# EAGLE design IA-prop (EAGLE 6.1)
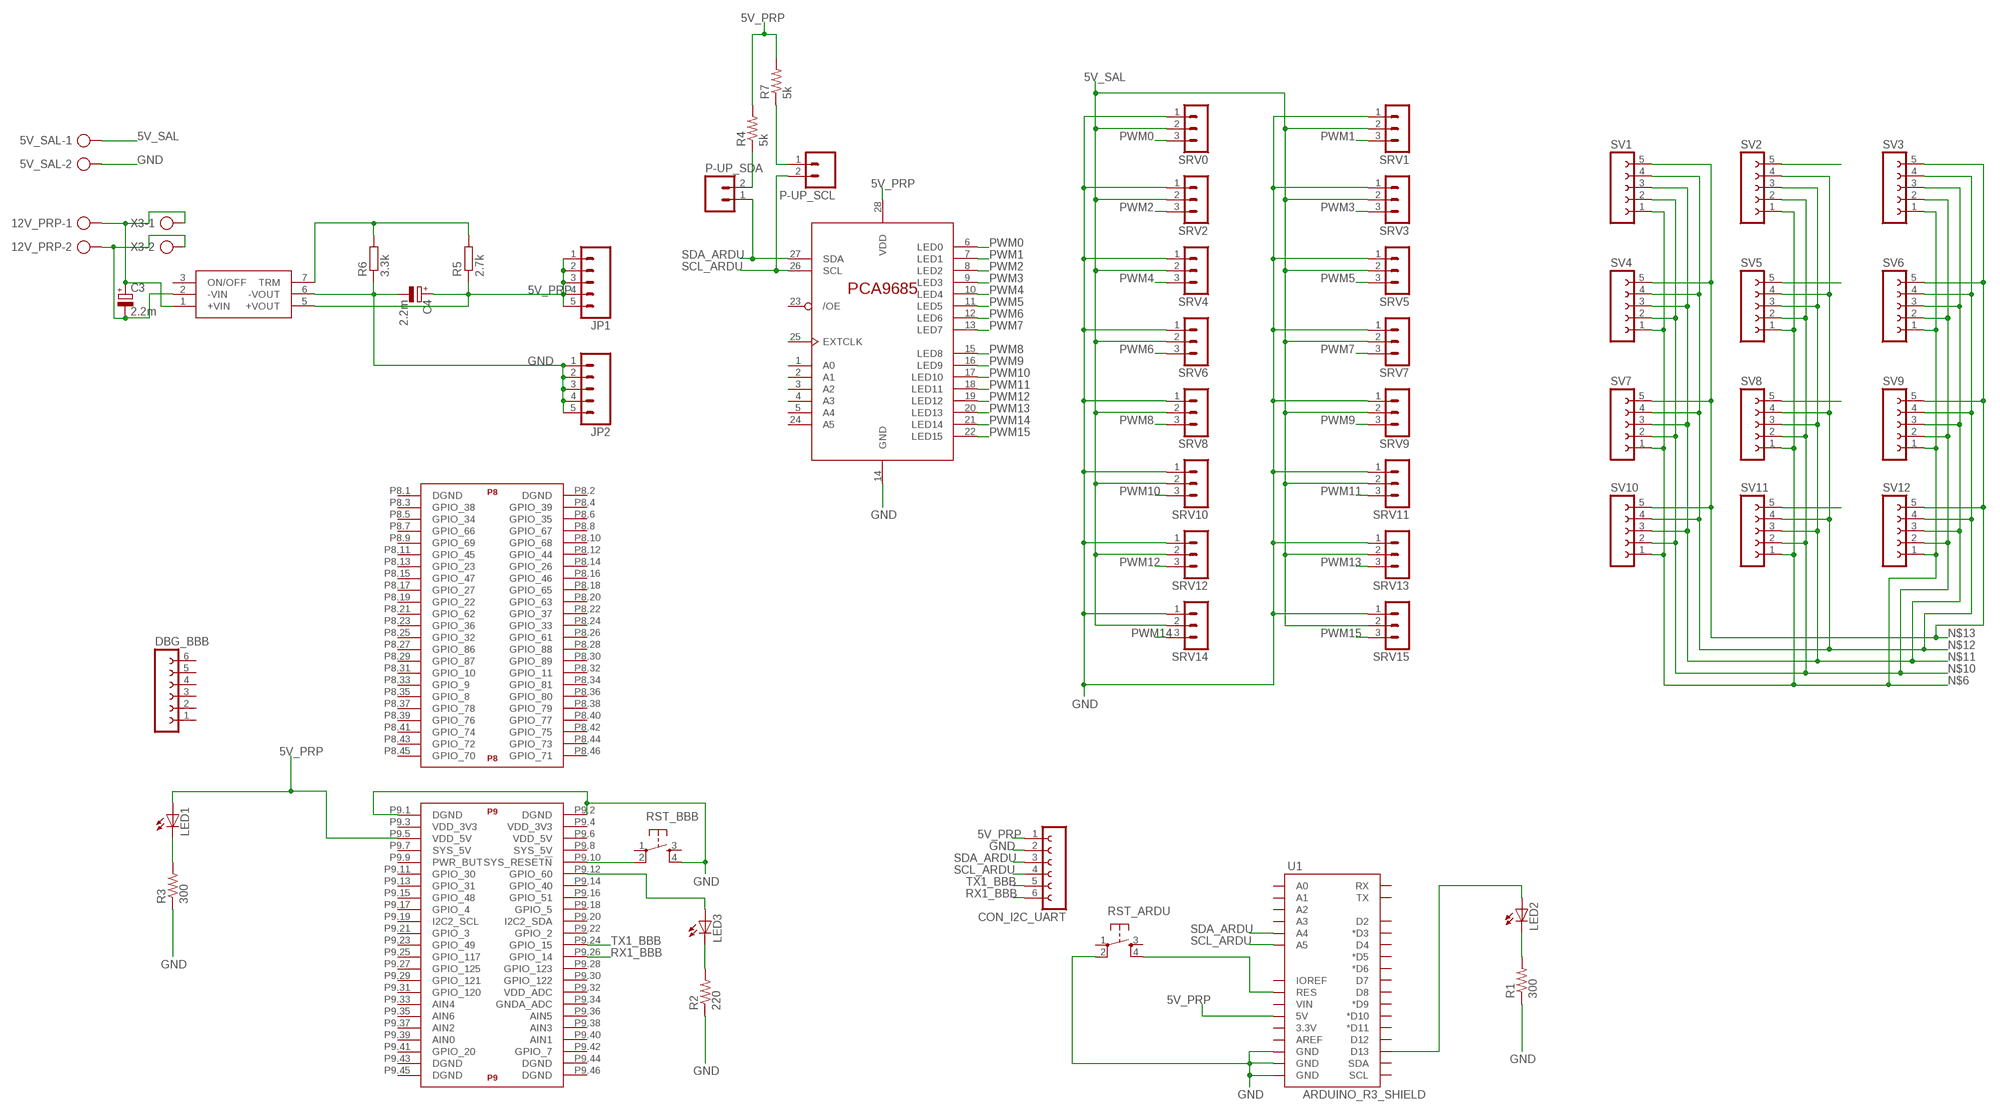
[diagram p0: schematic, sheet 1]

## Parts
5V_SAL  AK300/2  [AK300/2]
12V_PRP  AK300/2  [AK300/2]
C3  2.2m  CPOL-EUE5-13  [E5-13]
C4  2.2m  CPOL-EUE5-13  [E5-13]
CON_I2C_UART  FE06-1  [FE06]
DBG_BBB  FE06-1  [FE06]
JP1  M05PTH  [1X05]
JP2  M05PTH  [1X05]
LED1  LED3MM  [LED3MM]
LED2  LED3MM  [LED3MM]
LED3  LED3MM  [LED3MM]
P-UP_SCL  M02PTH  [1X02]
P-UP_SDA  M02PTH  [1X02]
R1  300  RESISTORAXIAL-0.3  [AXIAL-0.3]
R2  220  RESISTORAXIAL-0.3  [AXIAL-0.3]
R3  300  RESISTORAXIAL-0.3  [AXIAL-0.3]
R4  5k  RESISTORAXIAL-0.3  [AXIAL-0.3]
R5  2.7k  R-EU_0207/7  [0207/7]
R6  3.3k  R-EU_0207/7  [0207/7]
R7  5k  RESISTORAXIAL-0.3  [AXIAL-0.3]
RST_ARDU  TAC_SWITCHPTH  [TACTILE-PTH]
RST_BBB  TAC_SWITCHPTH  [TACTILE-PTH]
SRV0  MA03-1  [MA03-1]
SRV1  MA03-1  [MA03-1]
SRV2  MA03-1  [MA03-1]
SRV3  MA03-1  [MA03-1]
SRV4  MA03-1  [MA03-1]
SRV5  MA03-1  [MA03-1]
SRV6  MA03-1  [MA03-1]
SRV7  MA03-1  [MA03-1]
SRV8  MA03-1  [MA03-1]
SRV9  MA03-1  [MA03-1]
SRV10  MA03-1  [MA03-1]
SRV11  MA03-1  [MA03-1]
SRV12  MA03-1  [MA03-1]
SRV13  MA03-1  [MA03-1]
SRV14  MA03-1  [MA03-1]
SRV15  MA03-1  [MA03-1]
SV1  FE05-1  [FE05-1]
SV2  FE05-1  [FE05-1]
SV3  FE05-1  [FE05-1]
SV4  FE05-1  [FE05-1]
SV5  FE05-1  [FE05-1]
SV6  FE05-1  [FE05-1]
SV7  FE05-1  [FE05-1]
SV8  FE05-1  [FE05-1]
SV9  FE05-1  [FE05-1]
SV10  FE05-1  [FE05-1]
SV11  FE05-1  [FE05-1]
SV12  FE05-1  [FE05-1]
U1  ARDUINO_R3_SHIELD  [UNO_R3_SHIELD]
U$1  PCA9685PW  [TSSOP28]
U$2  TEN25-1211TEN25-1211  [TEN25]
U$3  BEAGLE_BONE_BLACK_CAPE  [BEAGLE_BONE_BLACK_CAPE]
X3  AK300/2  [AK300/2]

## Nets
5V_PRP: C4.+ CON_I2C_UART.1 JP1.1 JP1.2 JP1.3 JP1.4 JP1.5 LED1.A R4.P$2 R5.1 R7.P$2 U1.5V U$1.28(VDD) U$2.5(+VOUT) U$3.P9.5(P9:VDD_5V)
5V_PRP1: LED2.A U1.D13
5V_PRP2: LED3.A U$3.P9.12(P9:GPIO_60)
5V_SAL: 5V_SAL.1 SRV0.2 SRV1.2 SRV2.2 SRV3.2 SRV4.2 SRV5.2 SRV6.2 SRV7.2 SRV8.2 SRV9.2 SRV10.2 SRV11.2 SRV12.2 SRV13.2 SRV14.2 SRV15.2
+12V: 12V_PRP.1 C3.+ U$2.1(+VIN) X3.1
GND: 5V_SAL.2 C4.- CON_I2C_UART.2 JP2.1 JP2.2 JP2.3 JP2.4 JP2.5 R1.P$1 R2.P$1 R3.P$1 R6.1 RST_ARDU.2 RST_BBB.4 SRV0.1 SRV1.1 SRV2.1 SRV3.1 SRV4.1 SRV5.1 SRV6.1 SRV7.1 SRV8.1 SRV9.1 SRV10.1 SRV11.1 SRV12.1 SRV13.1 SRV14.1 SRV15.1 U1.GND@0(GND) U1.GND@1(GND) U1.GND@2(GND) U$1.14(GND) U$2.6(-VOUT) U$3.P9.1(P9:DGND) U$3.P9.2(P9:DGND)
GND_12: 12V_PRP.2 C3.- U$2.2(-VIN) X3.2
N$1: RST_BBB.2 U$3.P9.10(P9:SYS_RESET!N)
N$2: LED2.K(C) R1.P$2
N$3: LED3.K(C) R2.P$2
N$4: R5.2 R6.2 U$2.7(TRM)
N$5: P-UP_SDA.2 R4.P$1
N$6: SV1.1 SV2.1 SV3.1 SV4.1 SV5.1 SV6.1 SV7.1 SV8.1 SV9.1 SV10.1 SV11.1 SV12.1
N$7: LED1.K(C) R3.P$2
N$8: RST_ARDU.4 U1.RES
N$9: P-UP_SCL.1 R7.P$1
N$10: SV1.2 SV2.2 SV3.2 SV4.2 SV5.2 SV6.2 SV7.2 SV8.2 SV9.2 SV10.2 SV11.2 SV12.2
N$11: SV1.3 SV2.3 SV3.3 SV4.3 SV5.3 SV6.3 SV7.3 SV8.3 SV9.3 SV10.3 SV11.3 SV12.3
N$12: SV1.4 SV2.4 SV3.4 SV4.4 SV5.4 SV6.4 SV7.4 SV8.4 SV9.4 SV10.4 SV11.4 SV12.4
N$13: SV1.5 SV3.5 SV4.5 SV6.5 SV7.5 SV9.5 SV10.5 SV12.5
N$23: SV5.5
N$38: SV8.5
N$48: SV2.5
N$63: SV11.5
PWM0: SRV0.3 U$1.6(LED0)
PWM1: SRV1.3 U$1.7(LED1)
PWM2: SRV2.3 U$1.8(LED2)
PWM3: SRV3.3 U$1.9(LED3)
PWM4: SRV4.3 U$1.10(LED4)
PWM5: SRV5.3 U$1.11(LED5)
PWM6: SRV6.3 U$1.12(LED6)
PWM7: SRV7.3 U$1.13(LED7)
PWM8: SRV8.3 U$1.15(LED8)
PWM9: SRV9.3 U$1.16(LED9)
PWM10: SRV10.3 U$1.17(LED10)
PWM11: SRV11.3 U$1.18(LED11)
PWM12: SRV12.3 U$1.19(LED12)
PWM13: SRV13.3 U$1.20(LED13)
PWM14: SRV14.3 U$1.21(LED14)
PWM15: SRV15.3 U$1.22(LED15)
RX1_BBB: CON_I2C_UART.6 U$3.P9.26(P9:GPIO_14)
SCL_ARDU: CON_I2C_UART.4 P-UP_SCL.2 U1.A5 U$1.26(SCL)
SDA_ARDU: CON_I2C_UART.3 P-UP_SDA.1 U1.A4 U$1.27(SDA)
TX1_BBB: CON_I2C_UART.5 U$3.P9.24(P9:GPIO_15)
Unconnected: DBG_BBB.1 DBG_BBB.2 DBG_BBB.3 DBG_BBB.4 DBG_BBB.5 DBG_BBB.6 RST_ARDU.1 RST_ARDU.3 RST_BBB.1 RST_BBB.3 U1.3.3V U1.A0 U1.A1 U1.A2 U1.A3 U1.AREF U1.D2 U1.D3(*D3) U1.D4 U1.D5(*D5) U1.D6(*D6) U1.D7 U1.D8 U1.D9(*D9) U1.D10(*D10) U1.D11(*D11) U1.D12 U1.IOREF U1.RX U1.SCL U1.SDA U1.TX U1.VIN U$1.1(A0) U$1.2(A1) U$1.3(A2) U$1.4(A3) U$1.5(A4) U$1.23(/OE) U$1.24(A5) U$1.25(EXTCLK) U$2.3(ON/OFF) U$3.P8.1(P8:DGND) U$3.P8.2(P8:DGND) U$3.P8.3(P8:GPIO_38) U$3.P8.4(P8:GPIO_39) U$3.P8.5(P8:GPIO_34) U$3.P8.6(P8:GPIO_35) U$3.P8.7(P8:GPIO_66) U$3.P8.8(P8:GPIO_67) U$3.P8.9(P8:GPIO_69) U$3.P8.10(P8:GPIO_68) U$3.P8.11(P8:GPIO_45) U$3.P8.12(P8:GPIO_44) U$3.P8.13(P8:GPIO_23) U$3.P8.14(P8:GPIO_26) U$3.P8.15(P8:GPIO_47) U$3.P8.16(P8:GPIO_46) U$3.P8.17(P8:GPIO_27) U$3.P8.18(P8:GPIO_65) U$3.P8.19(P8:GPIO_22) U$3.P8.20(P8:GPIO_63) U$3.P8.21(P8:GPIO_62) U$3.P8.22(P8:GPIO_37) U$3.P8.23(P8:GPIO_36) U$3.P8.24(P8:GPIO_33) U$3.P8.25(P8:GPIO_32) U$3.P8.26(P8:GPIO_61) U$3.P8.27(P8:GPIO_86) U$3.P8.28(P8:GPIO_88) U$3.P8.29(P8:GPIO_87) U$3.P8.30(P8:GPIO_89) U$3.P8.31(P8:GPIO_10) U$3.P8.32(P8:GPIO_11) U$3.P8.33(P8:GPIO_9) U$3.P8.34(P8:GPIO_81) U$3.P8.35(P8:GPIO_8) U$3.P8.36(P8:GPIO_80) U$3.P8.37(P8:GPIO_78) U$3.P8.38(P8:GPIO_79) U$3.P8.39(P8:GPIO_76) U$3.P8.40(P8:GPIO_77) U$3.P8.41(P8:GPIO_74) U$3.P8.42(P8:GPIO_75) U$3.P8.43(P8:GPIO_72) U$3.P8.44(P8:GPIO_73) U$3.P8.45(P8:GPIO_70) U$3.P8.46(P8:GPIO_71) U$3.P9.3(P9:VDD_3V3) U$3.P9.4(P9:VDD_3V3) U$3.P9.6(P9:VDD_5V) U$3.P9.7(P9:SYS_5V) U$3.P9.8(P9:SYS_5V) U$3.P9.9(P9:PWR_BUT) U$3.P9.11(P9:GPIO_30) U$3.P9.13(P9:GPIO_31) U$3.P9.14(P9:GPIO_40) U$3.P9.15(P9:GPIO_48) U$3.P9.16(P9:GPIO_51) U$3.P9.17(P9:GPIO_4) U$3.P9.18(P9:GPIO_5) U$3.P9.19(P9:I2C2_SCL) U$3.P9.20(P9:I2C2_SDA) U$3.P9.21(P9:GPIO_3) U$3.P9.22(P9:GPIO_2) U$3.P9.23(P9:GPIO_49) U$3.P9.25(P9:GPIO_117) U$3.P9.27(P9:GPIO_125) U$3.P9.28(P9:GPIO_123) U$3.P9.29(P9:GPIO_121) U$3.P9.30(P9:GPIO_122) U$3.P9.31(P9:GPIO_120) U$3.P9.32(P9:VDD_ADC) U$3.P9.33(P9:AIN4) U$3.P9.34(P9:GNDA_ADC) U$3.P9.35(P9:AIN6) U$3.P9.36(P9:AIN5) U$3.P9.37(P9:AIN2) U$3.P9.38(P9:AIN3) U$3.P9.39(P9:AIN0) U$3.P9.40(P9:AIN1) U$3.P9.41(P9:GPIO_20) U$3.P9.42(P9:GPIO_7) U$3.P9.43(P9:DGND) U$3.P9.44(P9:DGND) U$3.P9.45(P9:DGND) U$3.P9.46(P9:DGND)

## Library data of the parts
5V_SAL 12V_PRP X3 = con-ptr500:AK300/2: CONNECTOR; OC_FARNELL: unknown; OC_NEWARK: unknown
C3 C4 = resistor:CPOL-EU: POLARIZED CAPACITOR, European symbol
CON_I2C_UART DBG_BBB = con-lsta:FE06-1: FEMALE HEADER; OC_FARNELL: unknown; OC_NEWARK: unknown
JP1 JP2 = SparkFun:M05: Header 5 Standard 5-pin 0.1" header. Use with straight break away headers (SKU : PRT-00116), right angle break away headers (PRT-00553), swiss pins (PRT-00743), machine pins (PRT-00117), and female headers (PRT-00115). Molex polarized connector foot print use with SKU : PRT-08230 with associated crimp pins and housings.
LED1-LED3 = SparkFun:LED: LEDs Standard schematic elements and footprints for 5mm, 3mm, 1206, and 0603 sized LEDs. 5mm - Spark Fun Electronics SKU : COM-00529 (and others)
P-UP_SCL P-UP_SDA = SparkFun:M02: Header 2 Standard 2-pin 0.1" header. Use with straight break away headers (SKU : PRT-00116), right angle break away headers (PRT-00553), swiss pins (PRT-00743), machine pins (PRT-00117), and female headers (PRT-00115). Molex polarized connector foot print use with SKU : PRT-08233 with associated crimp pins and housings.
R1-R4 R7 = SparkFun:RESISTOR: Resistor Basic schematic elements and footprints for 0603, 1206, and PTH resistors.
R5 R6 = resistor:R-EU_: RESISTOR, European symbol
RST_ARDU RST_BBB = SparkFun:TAC_SWITCH: Momentary Switch Button commonly used for reset or general input. Spark Fun Electronics SKU : COM-00097
SRV0 SRV1-SRV15 = con-lstb:MA03-1: PIN HEADER; OC_FARNELL: unknown; OC_NEWARK: unknown
SV1-SV12 = con-lsta:FE05-1: FEMALE HEADER; OC_FARNELL: unknown; OC_NEWARK: unknown
U1 = SparkFun-Boards:ARDUINO_R3_SHIELD: Shield form compatible with the Arduino Uno R3.
U$1 = PCA9685:PCA9685
U$2 = tracopower:TEN25-1211
U$3 = SparkFun-Boards:BEAGLE_BONE_BLACK_CAPE

## Board
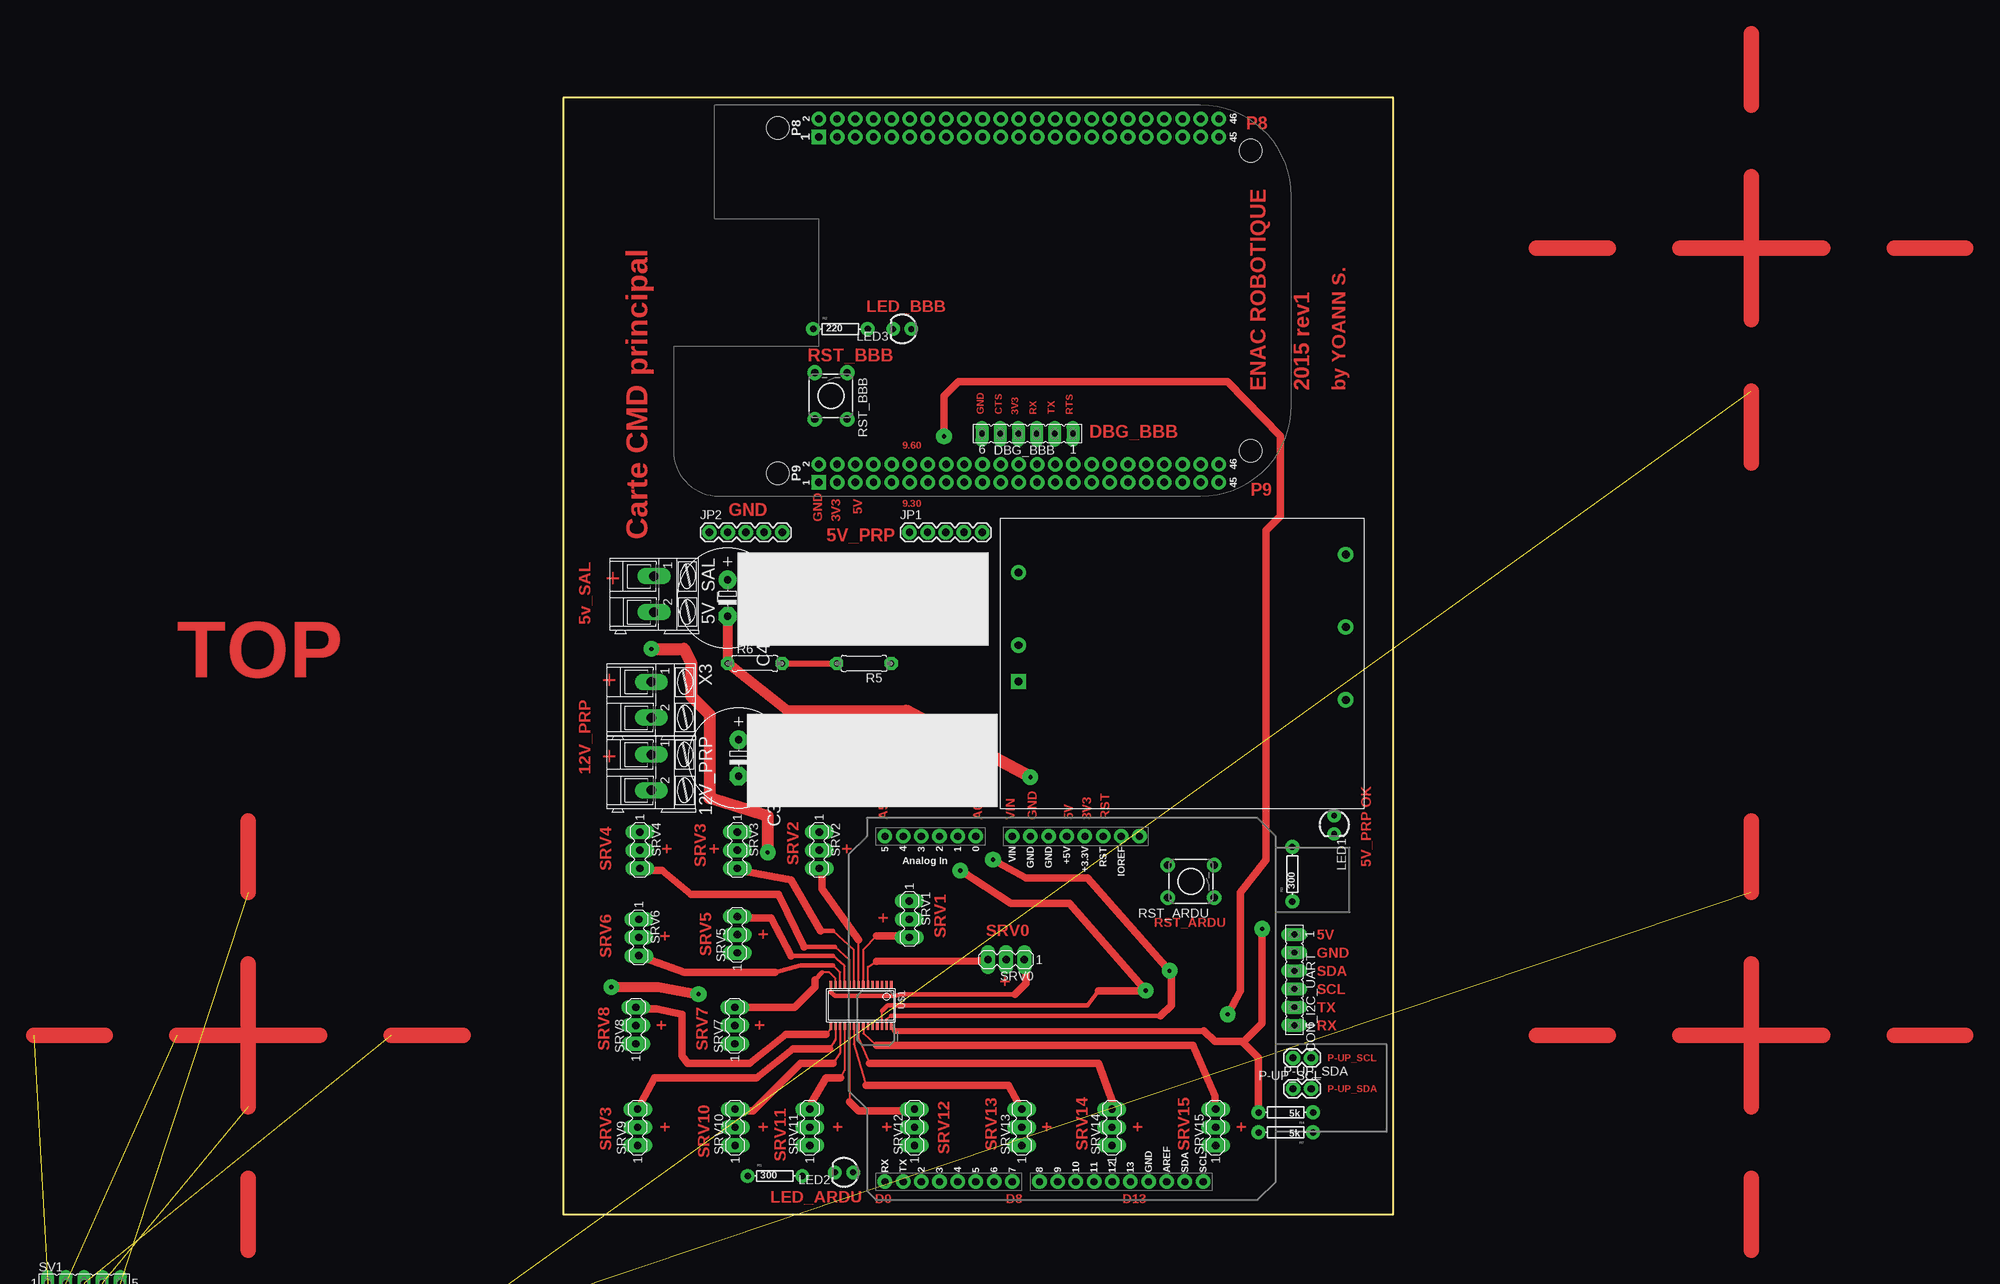
[diagram p1: board, top side]
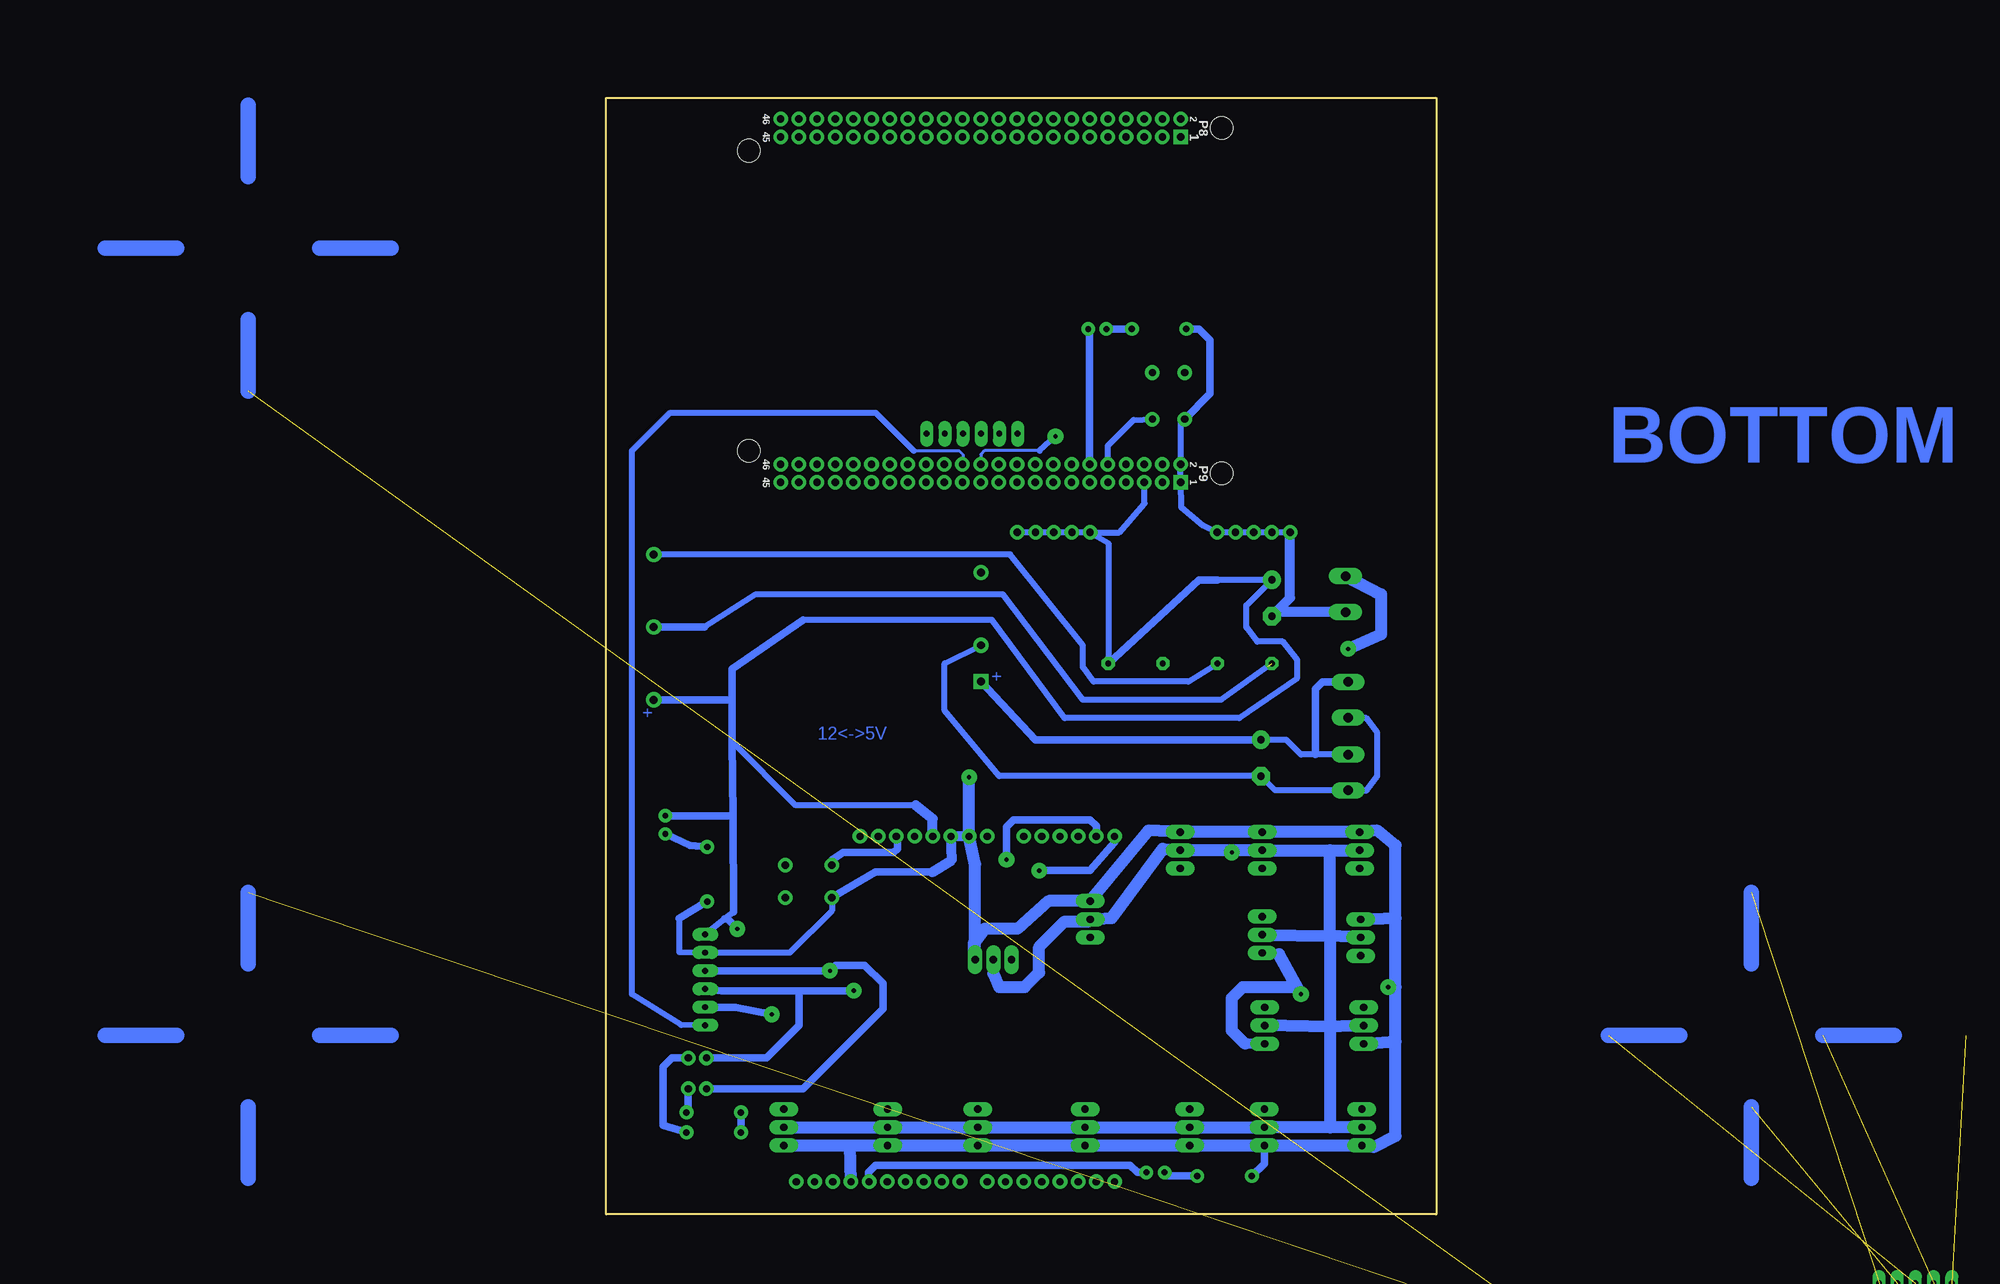
[diagram p2: board, bottom side, seen from below]

Size 116 x 156 mm. Coordinates in mm from the lower left corner, seen from the top.
Outline: 0,0 116,0 116,156 0,156 0,0
Copper layers (1*16): Top 0.035mm / dielectric 1.5mm / Bottom 0.035mm
Design rules: minimum track width 10mil, minimum drill 10mil, track to track 15mil, track to pad 15mil, pad to pad 15mil, via to via 15mil, smd to smd 8mil, copper to edge 40mil, drill to drill 8mil, minimum pad ring 15mil, minimum via ring 8mil, stop-mask expansion 4mil, vias tented up to drill 0mil, thermal gap 10mil

### Footprints (pad centres in the part's own frame; a part is rotated, then mirrored left to right if it is on the bottom)
AK300/2 = drill 1.321 long: 1 -2.515,0; 2 2.489,0
E5-13 = drill 1.016 pad 2.54: + -2.54,0 | drill 1.016 pad 2.54 octagon: - 2.54,0
FE06 = drill 0.813 long: 1 -6.35,0; 2 -3.81,0; 3 -1.27,0; 4 1.27,0; 5 3.81,0; 6 6.35,0
1X05 = drill 1.016 pad 1.88: 1 0,0; 2 2.54,0; 3 5.08,0; 4 7.62,0; 5 10.16,0
LED3MM = drill 0.813 pad 1.88: A -1.27,0; K 1.27,0
1X02 = drill 1.016 pad 1.88: 1 0,0; 2 2.54,0
AXIAL-0.3 = drill 0.9 pad 1.88: P$1 -3.81,0; P$2 3.81,0
0207/7 = drill 0.813 octagon: 1 -3.81,0; 2 3.81,0
TACTILE-PTH = drill 1.016 pad 1.88: 1 -3.251,2.261; 2 3.251,2.261; 3 -3.251,-2.261; 4 3.251,-2.261
MA03-1 = drill 1.016 long: 1 -2.54,0; 2 0,0; 3 2.54,0
FE05-1 = drill 0.813 long: 1 -5.08,0; 2 -2.54,0; 3 0,0; 4 2.54,0; 5 5.08,0
UNO_R3_SHIELD = drill 1.016 pad 1.88: 3.3V 50.8,26.67; 5V 50.8,29.21; A0 50.8,41.91; A1 50.8,44.45; A2 50.8,46.99; A3 50.8,49.53; A4 50.8,52.07; A5 50.8,54.61; AREF 2.54,15.24; D2 2.54,49.53; D3 2.54,46.99; D4 2.54,44.45; D5 2.54,41.91; D6 2.54,39.37; D7 2.54,36.83; D8 2.54,33.02; D9 2.54,30.48; D10 2.54,27.94; D11 2.54,25.4; D12 2.54,22.86; D13 2.54,20.32; GND@0 50.8,31.75; GND@1 50.8,34.29; GND@2 2.54,17.78; IOREF 50.8,21.59; NC 50.8,19.05; RES 50.8,24.13; RX 2.54,54.61; SCL 2.54,10.16; SDA 2.54,12.7; TX 2.54,52.07; VIN 50.8,36.83
TSSOP28 = smd 0.305 x 0.991: 1 -4.225,-2.918; 2 -3.575,-2.918; 3 -2.925,-2.918; 4 -2.275,-2.918; 5 -1.625,-2.918; 6 -0.975,-2.918; 7 -0.325,-2.918; 8 0.325,-2.918; 9 0.975,-2.918; 10 1.625,-2.918; 11 2.275,-2.918; 12 2.925,-2.918; 13 3.575,-2.918; 14 4.225,-2.918; 15 4.225,2.918; 16 3.575,2.918; 17 2.925,2.918; 18 2.275,2.918; 19 1.625,2.918; 20 0.975,2.918; 21 0.325,2.918; 22 -0.325,2.918; 23 -0.975,2.918; 24 -1.625,2.918; 25 -2.275,2.918; 26 -2.925,2.918; 27 -3.575,2.918; 28 -4.225,2.918
TEN25 = drill 1.1 pad 1.778 square: 1 0,0 | drill 1.1 pad 1.778: 2 0,5.08; 3 0,15.24; 5 45.72,-2.54; 6 45.72,7.62; 7 45.72,17.78
BEAGLE_BONE_BLACK_CAPE = drill 1.016 pad 1.88 square: P8.1 20.32,50.165; P9.1 20.32,1.905 | drill 1.016 pad 1.88: P8.2 20.32,52.705; P8.3 22.86,50.165; P8.4 22.86,52.705; P8.5 25.4,50.165; P8.6 25.4,52.705; P8.7 27.94,50.165; P8.8 27.94,52.705; P8.9 30.48,50.165; P8.10 30.48,52.705; P8.11 33.02,50.165; P8.12 33.02,52.705; P8.13 35.56,50.165; P8.14 35.56,52.705; P8.15 38.1,50.165; P8.16 38.1,52.705; P8.17 40.64,50.165; P8.18 40.64,52.705; P8.19 43.18,50.165; P8.20 43.18,52.705; P8.21 45.72,50.165; P8.22 45.72,52.705; P8.23 48.26,50.165; P8.24 48.26,52.705; P8.25 50.8,50.165; P8.26 50.8,52.705; P8.27 53.34,50.165; P8.28 53.34,52.705; P8.29 55.88,50.165; P8.30 55.88,52.705; P8.31 58.42,50.165; P8.32 58.42,52.705; P8.33 60.96,50.165; P8.34 60.96,52.705; P8.35 63.5,50.165; P8.36 63.5,52.705; P8.37 66.04,50.165; P8.38 66.04,52.705; P8.39 68.58,50.165; P8.40 68.58,52.705; P8.41 71.12,50.165; P8.42 71.12,52.705; P8.43 73.66,50.165; P8.44 73.66,52.705; P8.45 76.2,50.165; P8.46 76.2,52.705; P9.2 20.32,4.445; P9.3 22.86,1.905; P9.4 22.86,4.445; P9.5 25.4,1.905; P9.6 25.4,4.445; P9.7 27.94,1.905; P9.8 27.94,4.445; P9.9 30.48,1.905; P9.10 30.48,4.445; P9.11 33.02,1.905; P9.12 33.02,4.445; P9.13 35.56,1.905; P9.14 35.56,4.445; P9.15 38.1,1.905; P9.16 38.1,4.445; P9.17 40.64,1.905; P9.18 40.64,4.445; P9.19 43.18,1.905; P9.20 43.18,4.445; P9.21 45.72,1.905; P9.22 45.72,4.445; P9.23 48.26,1.905; P9.24 48.26,4.445; P9.25 50.8,1.905; P9.26 50.8,4.445; P9.27 53.34,1.905; P9.28 53.34,4.445; P9.29 55.88,1.905; P9.30 55.88,4.445; P9.31 58.42,1.905; P9.32 58.42,4.445; P9.33 60.96,1.905; P9.34 60.96,4.445; P9.35 63.5,1.905; P9.36 63.5,4.445; P9.37 66.04,1.905; P9.38 66.04,4.445; P9.39 68.58,1.905; P9.40 68.58,4.445; P9.41 71.12,1.905; P9.42 71.12,4.445; P9.43 73.66,1.905; P9.44 73.66,4.445; P9.45 76.2,1.905; P9.46 76.2,4.445 | hole 3.175: 14.605,3.175; 80.645,6.35; 80.645,48.26; 14.605,51.435

### Placement (x,y rotation side)
5V_SAL  12.7,86.65 270 top
12V_PRP  12.31,61.74 270 top
C3  24.5,63.77 270 top
C4  22.98,86.12 270 top
CON_I2C_UART  102.16,32.76 270 top
DBG_BBB  64.87,109.08 180 top
JP1  48.38,95.3 0 top
JP2  20.44,95.3 0 top
LED1  107.72,54.42 270 top
LED2  39.24,5.86 180 top
LED3  47.36,123.71 180 top
P-UP_SCL  104.51,21.86 180 top
P-UP_SDA  101.97,17.54 0 top
R1  29.58,5.35 0 top
R2  38.73,123.71 0 top
R3  101.88,47.53 90 top
R4  100.96,14.24 180 top
R5  42.03,76.98 180 top
R6  26.79,76.98 0 top
R7  100.96,11.44 180 top
RST_ARDU  87.71,46.52 180 top
RST_BBB  37.41,114.37 270 top
SRV0  61.9,35.59 180 top
SRV1  48.37,41.22 270 top
SRV2  35.77,50.87 270 top
SRV3  24.33,50.87 270 top
SRV4  10.71,50.87 270 top
SRV5  24.32,39.07 90 top
SRV6  10.56,38.68 270 top
SRV7  23.98,26.37 90 top
SRV8  10.16,26.37 90 top
SRV9  10.41,12.15 90 top
SRV10  24.03,12.15 90 top
SRV11  34.45,12.15 90 top
SRV12  49.09,12.15 90 top
SRV13  64.07,12.15 90 top
SRV14  76.67,12.15 90 top
SRV15  91.16,12.15 90 top
SV1  -66.94,-9.64 0 top  (outside the outline)
SV2  -66.94,-15.23 0 top  (outside the outline)
SV3  -66.94,-20.81 0 top  (outside the outline)
SV4  -66.94,-26.4 0 top  (outside the outline)
SV5  -66.94,-31.99 0 top  (outside the outline)
SV6  -66.94,-37.58 0 top  (outside the outline)
SV7  -66.94,-43.17 0 top  (outside the outline)
SV8  -66.94,-48.75 0 top  (outside the outline)
SV9  -66.94,-54.34 0 top  (outside the outline)
SV10  -66.94,-59.93 0 top  (outside the outline)
SV11  -66.94,-65.52 0 top  (outside the outline)
SV12  -66.94,-71.11 0 top  (outside the outline)
U1  99.57,2.02 90 top
U$1  41.61,29.19 180 top
U$2  63.62,74.44 0 top
U$3  15.41,100.37 0 top
X3  12.31,71.9 270 top

### Tracks (layer width: path | path; a pad name or v marks a point on that pad's centre or on a via)
5V_PRP  (via drill 0.6 pad 2.18)
  Top 0.305: U$1.28 45.84,26.18 46.35,25.67
  Top 0.813: 46.35,25.67 89.53,25.67
  Top 1.016: 89.53,25.67 91.05,24.14 94.86,24.14 | 94.86,24.14 95.12,24.14 97.66,26.68 v97.66,39.89 | R4.P$2 97.15,21.86 94.86,24.14
  Bottom 0.813: JP1.1 JP1.2 JP1.3 JP1.4 JP1.5 | 30.6,88.66 C4.+ 26.54,85.1 26.54,82.06 25.01,80.02 21.46,80.02 19.42,77.48 19.42,74.94 27.55,69.36 51.94,69.36 62.1,83.07 88.51,83.07 | JP1.1 45.84,93.77 R5.1 | 98.16,42.27 99.45,41.25 CON_I2C_UART.1 | 72.76,57.16 89.53,57.16 98.42,66.05 | JP1.1 44.28,95.3 40.76,99.33 U$3.P9.5
  Bottom 1.016: 30.6,88.66 33.14,88.66 R5.1 | 98.16,42.27 98.29,55.64 | 98.29,55.64 98.42,66.05 98.42,71.9 | 98.42,71.9 98.42,76.21 88.51,83.07 | U$2.5 98.42,71.9 | LED1.A 98.29,55.64 | v97.66,39.89 99.01,41.25 99.45,41.25 | R7.P$2 R4.P$2
  Bottom 1.422: U1.5V 70.36,55.27 72.76,57.16
5V_PRP1
  Bottom 1.016: LED2.A 41.78,5.86 42.79,6.87 78.35,6.87 79.37,5.86 79.37,4.67 U1.D13
5V_PRP2
  Bottom 1.016: U$3.P9.12 48.43,123.51 LED3.A
5V_SAL  (via drill 0.6 pad 2.18)
  Top 0.305: 91.35,11.95 SRV15.2
  Top 1.676: v12.31,79.01 16.88,79.01 17.9,76.98 17.9,72.4 20.44,69.86 20.44,58.18 28.57,55.64 v28.57,50.56
  Bottom 1.016: SRV0.2 61.9,33.6 | 48.68,40.91 SRV1.2 | v28.57,50.56 28.37,50.56 28.06,50.87
  Bottom 1.676: SRV15.2 SRV14.2 SRV13.2 SRV12.2 SRV11.2 SRV10.2 14.85,12.15 | SRV9.2 14.85,12.15 | 14.85,38.88 14.85,26.18 | SRV6.2 14.85,38.88 | SRV8.2 14.85,26.18 | 14.85,50.87 SRV3.2 28.06,50.87 SRV2.2 38.22,51.07 45.33,41.42 SRV1.2 | 14.85,50.87 SRV4.2 | 61.9,33.6 61.08,31.76 57.52,31.76 55.49,33.8 55.49,37.35 51.94,40.91 48.68,40.91 | 14.85,26.18 14.85,12.15 | 14.85,26.18 SRV7.2 | 14.85,38.88 14.85,50.87 | SRV5.2 14.85,38.88 | 5V_SAL.1 7.74,86.63 7.74,81.04 v12.31,79.01
+12V
  Bottom 0.813: 12V_PRP.1 16.88,64.25 18.89,64.25 20.95,66.31 C3.+
  Bottom 1.016: U$2.1 56,66.31 C3.+ | X3.1 15.89,74.41 16.88,73.42 16.88,64.25
GND  (via drill 0.6 pad 2.18)  (1 unrouted)
  Top 0.305: U$1.14 37.39,31.07 | 64.64,35.39 SRV0.1
  Top 0.61: 37.39,31.07 37.97,30.49 46.35,30.49 47.11,30.75 63.11,30.75
  Top 1.016: 63.11,30.75 64.64,32.27 64.64,35.39
  Top 1.422: C4.- R6.1 | 47.87,70.37 31.27,70.37 23.56,76.56 | v6.72,31.76 13.33,31.76 v18.92,30.75
  Top 1.676: v65.28,61.09 47.87,70.37
  Bottom 0.813: JP2.1 JP2.2 JP2.3 JP2.4 JP2.5 32.63,96.28 35.68,98.82 U$3.P9.1 U$3.P9.2 35.73,110.54 RST_BBB.4 | R6.1 30.09,71.9 49.4,71.9 60.57,86.63 95.12,86.63 102.23,82.06 | 105.83,41.37 105.78,36.64 CON_I2C_UART.2 90.31,36.57 84.46,42.42 RST_ARDU.2 | SRV9.1 8.76,9.41
  Bottom 1.016: 102.23,82.06 U$2.6 | 64.64,35.78 SRV0.1 | 22.4,84.16 C4.- | SRV5.1 21.96,36.34 | v6.72,31.76 5.71,31.76 | v18.92,30.75 19.25,31.35 19.66,31.76 | R3.P$1 105.83,41.37 | R2.P$1 33.14,123.71 31.62,122.19 31.62,114.65 RST_BBB.4 | SRV10.1 24.03,7.09 R1.P$1 | 70.42,47.82 78.36,47.82 RST_ARDU.2
  Bottom 1.422: C4.- 20.44,86.12 JP2.1 | U1.GND@1 U1.GND@0 67.68,49.54 70.42,47.82 | 5V_SAL.2 22.4,84.16 | SRV7.1 26.73,23.83
  Bottom 1.676: v65.28,61.09 U1.GND@1 64.44,48.93 SRV0.1 | SRV15.1 81.91,9.61 | 81.91,9.61 SRV14.1 SRV13.1 SRV12.1 SRV11.1 SRV10.1 SRV9.1 | 8.76,9.41 5.71,10.94 5.71,24.14 | 5.71,24.14 5.71,31.76 5.71,41.42 | 5.71,41.42 5.71,51.58 8.25,53.61 SRV4.1 SRV3.1 SRV2.1 40.25,53.61 SRV1.1 54.16,43.76 58.54,39.89 63.11,39.89 64.64,37.86 64.64,35.78 | SRV6.1 5.71,41.42 | SRV8.1 5.71,24.14 | U1.GND@2 81.91,9.61 | 19.25,31.35 21.96,36.34 | 26.73,23.83 28.57,25.67 28.57,30.24 27.04,31.76 19.66,31.76
GND_12
  Bottom 0.813: X3.2 9.77,69.36 8.25,67.32 8.25,61.23 9.77,59.2 12V_PRP.2 22.52,59.25 C3.- 61.08,61.23 68.7,70.37 68.7,76.98 U$2.2
N$1
  Bottom 0.813: U$3.P9.10 45.89,107.4 42.28,111.01 RST_BBB.2
N$2
  Bottom 1.016: R1.P$2 37.46,5.35 LED2.K
N$3
  Bottom 1.016: LED3.K R2.P$2
N$4
  Top 0.813: R6.2 R5.2
  Bottom 0.813: R6.2 34.66,74.44 47.87,74.44 49.4,76.47 49.4,79.52 59.56,92.22 U$2.7
N$5
  Bottom 1.016: P-UP_SDA.2 104.51,14.49 R4.P$1
N$6  (12 unrouted)
  Top 2.184: -74,25 -64,25
N$7
  Bottom 1.016: LED1.K 104.26,51.58 R3.P$2
N$8
  Bottom 1.016: RST_ARDU.4 84.46,49.55 82.92,50.56 75.81,50.56 75.3,51.07 75.3,52.68 U1.RES
N$9
  Bottom 1.016: P-UP_SCL.1 106.8,21.86 108.07,20.59 108.07,12.46 R7.P$1
N$10  (12 unrouted)
  Top 2.184: -54,25 -34,25
N$11  (12 unrouted)
  Top 2.184: -24,25 -14,25
N$12  (12 unrouted)
  Top 2.184: -44,35 -44,15
N$13  (8 unrouted)
  Top 2.184: -44,45 -44,55
N$14
  Top 2.184: -44,5 -44,-5
N$15
  Bottom 2.184: -44,45 -44,35
N$16
  Bottom 2.184: -64,25 -54,25
N$17
  Bottom 2.184: -34,25 -24,25
N$18
  Bottom 2.184: -44,15 -44,5
N$19
  Top 2.184: 136,25 146,25
N$20
  Top 2.184: 156,25 176,25
N$21
  Top 2.184: 186,25 196,25
N$22
  Top 2.184: 166,35 166,15
N$23  (1 unrouted)
  Top 2.184: 166,45 166,55
N$24
  Top 2.184: 166,5 166,-5
N$25
  Bottom 2.184: 166,45 166,35
N$26
  Bottom 2.184: 146,25 156,25
N$27
  Bottom 2.184: 176,25 186,25
N$28
  Bottom 2.184: 166,15 166,5
N$29
  Top 2.184: 136,135 146,135
N$30
  Top 2.184: 156,135 176,135
N$31
  Top 2.184: 186,135 196,135
N$32
  Top 2.184: 166,145 166,125
N$33
  Top 2.184: 166,155 166,165
N$34
  Top 2.184: 166,115 166,105
N$35
  Bottom 2.184: 166,155 166,145
N$36
  Bottom 2.184: 146,135 156,135
N$37
  Bottom 2.184: 176,135 186,135
N$38  (1 unrouted)
  Bottom 2.184: 166,125 166,115
PWM0
  Top 0.305: U$1.6 42.59,34.61 43.81,35.32
  Top 1.016: 43.81,35.32 58.03,35.39 SRV0.3
PWM1
  Top 0.305: U$1.7 41.94,37 43.81,38.88
  Top 1.016: 43.81,38.88 48.18,38.88 SRV1.3
PWM2
  Top 0.305: U$1.8 41.29,38.35
  Top 1.016: 41.29,38.35 36.19,45.48 36.19,47.91 SRV2.3
PWM3
  Top 0.305: U$1.9 40.64,36.97 37.71,39.64 | 24.64,48.02 SRV3.3
  Top 0.61: 37.71,39.64 35.93,39.64
  Top 1.016: 35.93,39.64 31.87,46.75 24.64,48.02
PWM4
  Top 0.305: U$1.10 39.99,35.59 37.97,37.35 | 11.02,48.02 SRV4.3
  Top 0.61: 37.97,37.35 33.65,37.35
  Top 1.016: 33.65,37.35 30.09,44.72 17.9,44.72 13.84,48.02 11.02,48.02
PWM5
  Top 0.305: U$1.11 39.34,34.71 37.71,36.08 | 24.52,41.42 SRV5.3
  Top 0.61: 37.71,36.08 31.87,36.08
  Top 1.016: 31.87,36.08 29.08,41.42 24.52,41.42
PWM6
  Top 0.305: U$1.12 38.69,33.84 37.71,34.81
  Top 0.61: 37.71,34.81 33.14,34.81 29.58,33.8
  Top 1.016: 29.58,33.8 16.97,33.8 SRV6.3
PWM7
  Top 0.305: U$1.13 38.04,32.96 37.2,33.8 36.19,33.8
  Top 0.61: 35.17,32.78 36.19,33.8
  Top 1.016: SRV7.3 32.32,28.91 35.17,31.76 35.17,32.78
PWM8
  Top 0.305: 10.87,28.72 SRV8.3 | U$1.15 37.39,25.85 36.7,25.16
  Top 1.016: 10.87,28.72 13.07,28.72 16.63,27.95 16.63,22.11 17.39,21.1 26.03,21.1 31.11,25.16 36.7,25.16
PWM9
  Top 0.305: U$1.16 38.04,24.47 37.2,23.13
  Top 1.016: 37.2,23.13 32.12,23.13 27.04,19.06 12.76,19.06 SRV9.3
PWM10
  Top 0.305: U$1.17 38.69,22.58 37.71,21.1 | 24.23,14.49 SRV10.3
  Top 1.016: 37.71,21.1 33.14,21.1 26.54,14.49 24.23,14.49
PWM11
  Top 0.305: U$1.18 39.34,20.18 38.73,19.06 | 34.66,15.51 34.66,14.9
  Top 1.016: 38.73,19.06 36.7,19.06 34.66,15.51 | 34.66,14.9 SRV11.3
PWM12
  Top 0.305: U$1.19 39.99,15.75 | 47.36,14.49 48.89,14.89
  Top 1.016: 39.99,15.75 41.27,14.49 47.36,14.49 | 48.89,14.89 SRV12.3
PWM13
  Top 0.305: U$1.20 40.64,23.76 42.28,18.05
  Top 1.016: 42.28,18.05 62.23,18.05 SRV13.3
PWM14
  Top 0.305: U$1.21 41.29,24.63 42.79,21.1
  Top 1.016: 42.79,21.1 74.8,21.1 76.83,15.51 76.83,14.84 SRV14.3
PWM15
  Top 0.305: U$1.22 41.94,25.25 43.81,23.64
  Top 1.016: 43.81,23.64 88,23.64 91.05,16.52 91.05,14.79 SRV15.3
RX1_BBB
  Bottom 0.406: 73.02,106.69 66.67,106.69 66.16,106.19 66.16,104.86 U$3.P9.26
  Bottom 0.813: CON_I2C_UART.6 105.51,26.45 112.39,30.75 112.39,106.69 107.05,112.03 78.35,112.03 73.02,106.69
SCL_ARDU  (via drill 0.6 pad 2.18)
  Top 0.305: U$1.26 44.54,28.43
  Top 0.61: 44.54,28.43 45.33,29.22 73.27,29.22 74.8,31.26
  Top 1.016: 74.8,31.26 v81.4,31.26 70.73,43.45 62.6,43.45 v55.49,48.02
  Bottom 1.016: U1.A5 44.96,51.95 48.38,48.02 v55.49,48.02 | 89.27,31.26 99.89,31.26 CON_I2C_UART.4 | 89.27,31.26 v81.4,31.26 | P-UP_SCL.2 93.59,21.86 89.02,26.43 89.02,31 89.27,31.26
SDA_ARDU  (via drill 0.6 pad 2.18)
  Top 0.305: U$1.27 45.19,27.3 45.84,27.7 | 84.96,33.8 v84.72,34.03
  Top 0.61: 83.43,27.7 47.11,27.7 45.84,27.7
  Top 1.016: v60.06,49.54 64.64,47 73.27,47 v84.72,34.03 | 83.43,27.7 84.96,29.22 84.96,33.8
  Bottom 1.016: U1.A4 47.5,54.25 48.38,55.13 59.05,55.13 60.06,54.12 v60.06,49.54 | CON_I2C_UART.3 v84.72,34.03 83.94,34.81 79.88,34.81 77.34,32.27 77.34,28.72 88.51,17.54 P-UP_SDA.1
TX1_BBB  (via drill 0.6 pad 2.18)
  Top 1.016: v92.85,27.93 94.61,31.26 94.61,44.97 98.16,49.54 98.16,95.52 100.2,97.55 100.2,108.73 92.83,116.35 55.24,116.35 53.21,114.31 v53.21,108.73
  Bottom 0.406: 55.44,106.69 63.11,106.69 63.62,106.19 63.62,104.86 U$3.P9.24
  Bottom 0.813: 55.44,106.69 v53.21,108.73
  Bottom 1.016: CON_I2C_UART.5 97.93,28.95 v92.85,27.93

### Text on the board
Top: P8 | LED_BBB | RST_BBB | ENAC ROBOTIQUE | 2015 rev1 | by YOANN S. | GND | CTS | 3V3 | RX | TX | RTS | DBG_BBB | 9.60 | P9 | GND | 9.30 | 5V | GND | 3V3 | 5V_PRP | Carte CMD principal | 5v_SAL | + | TOP | + | 12V_PRP | + | A5 | A0 | VIN | GND | 5V | 3V3 | RST | + | + | + | SRV3 | SRV2 | 5V_PRP OK | SRV4 | + | RST_ARDU | SRV1 | SRV0 | + | + | 5V | SRV6 | SRV5 | GND | SDA | + | SCL | TX | + | + | RX | SRV8 | SRV7 | P-UP_SCL | P-UP_SDA | + | + | + | + | + | + | + | SRV3 | SRV13 | SRV14 | SRV15 | SRV10 | SRV12 | SRV11 | LED_ARDU | D0 | D8 | D13
Bottom: BOTTOM | + | + | 12<->5V